# EAGLE design WiFi-Bee_v10 (EAGLE 7.7.0)
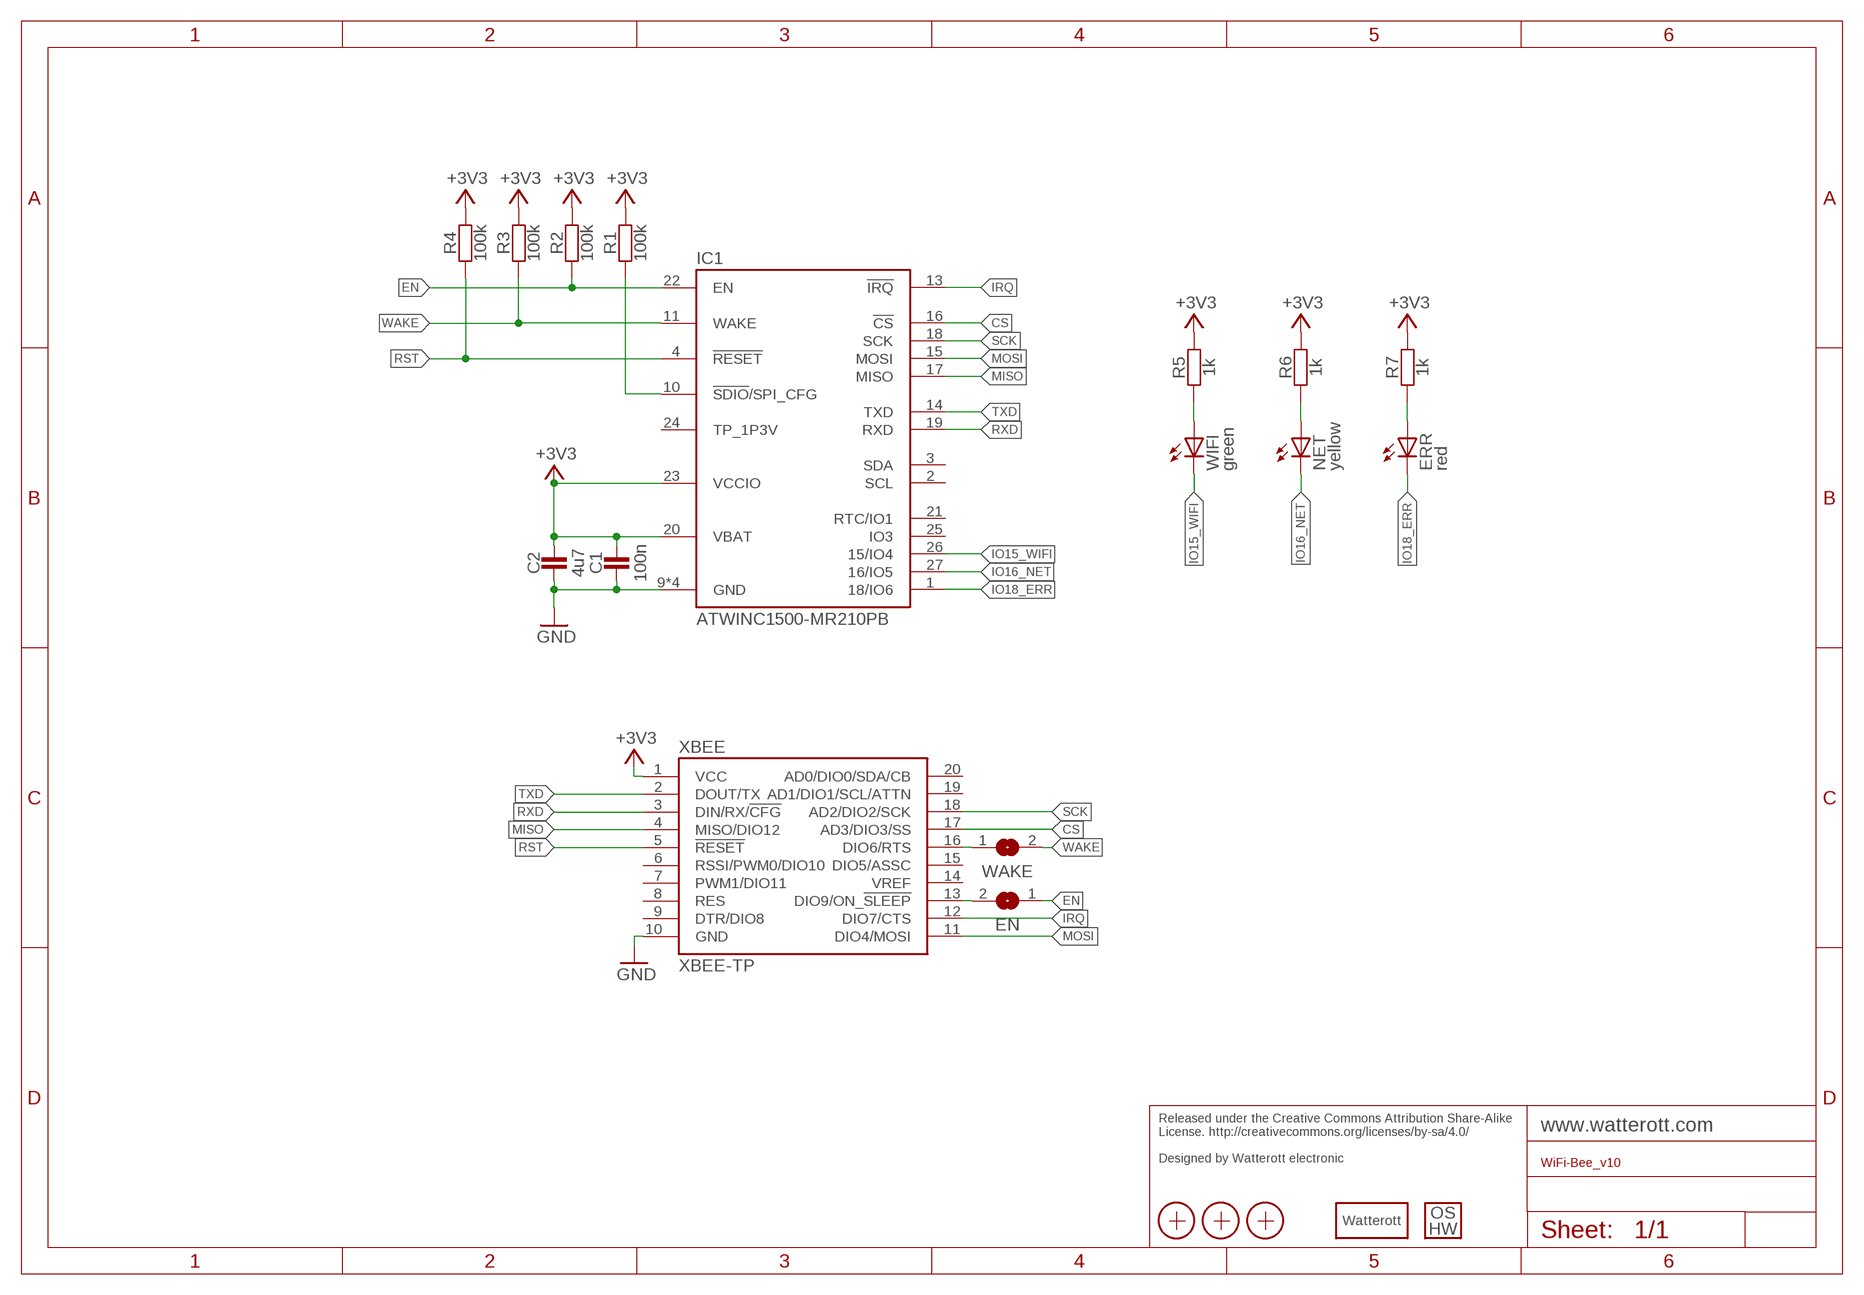
[diagram p0: schematic, sheet 1]

## Parts
C1  100n  CAPACITOR-0402  [C0402]
C2  4u7  CAPACITOR-0402  [C0402]
EN  JUMPER2-0402  [JUMPER2-0402]
ERR  red  LED-0603  [C0603]
IC1  ATWINC1500-MR210PB  [ATWINC1500-MX210]
LOGO3  LOGO_SPARK-2  [SPARK_2MM]
LOGO4  LOGO_OSHW-2  [OSHW_2MM]
NET  yellow  LED-0603  [C0603]
R1  100k  RESISTOR-0402  [C0402]
R2  100k  RESISTOR-0402  [C0402]
R3  100k  RESISTOR-0402  [C0402]
R4  100k  RESISTOR-0402  [C0402]
R5  1k  RESISTOR-0402  [C0402]
R6  1k  RESISTOR-0402  [C0402]
R7  1k  RESISTOR-0402  [C0402]
WAKE  JUMPER2-0402  [JUMPER2-0402]
WIFI  green  LED-0603  [C0603]
X1  PASSER-07  [PASSER_07MM]
X2  PASSER-07  [PASSER_07MM]
X3  PASSER-07  [PASSER_07MM]
XBEE  XBEE-TP  [XBEE_TP]

## Nets
+3V3: C1.2 C2.2 IC1.20(VBAT) IC1.23(VCCIO) R1.2 R2.2 R3.2 R4.2 R5.2 R6.2 R7.2 XBEE.1(VCC)
CFG: IC1.10(!SDIO!/SPI_CFG) R1.1
CS: IC1.16(!CS) XBEE.17(AD3/DIO3/SS)
EN: EN.1 IC1.22(EN) R2.1
EN2: EN.2 XBEE.13(DIO9/ON_!SLEEP!)
GND: C1.1 C2.1 IC1.9(GND) IC1.12(GND) IC1.28(GND) IC1.GND XBEE.10(GND)
IO15_WIFI: IC1.26(15/IO4) WIFI.C
IO16_NET: IC1.27(16/IO5) NET.C
IO18_ERR: ERR.C IC1.1(18/IO6)
IRQ: IC1.13(!IRQ) XBEE.12(DIO7/CTS)
LEDE: ERR.A R7.1
LEDN: NET.A R6.1
LEDW: R5.1 WIFI.A
MISO: IC1.17(MISO) XBEE.4(MISO/DIO12)
MOSI: IC1.15(MOSI) XBEE.11(DIO4/MOSI)
RST: IC1.4(!RESET) R4.1 XBEE.5(!RESET!)
RXD: IC1.19(RXD) XBEE.3(DIN/RX/!CFG!)
SCK: IC1.18(SCK) XBEE.18(AD2/DIO2/SCK)
TXD: IC1.14(TXD) XBEE.2(DOUT/TX)
WAKE: IC1.11(WAKE) R3.1 WAKE.2
WAKE1: WAKE.1 XBEE.16(DIO6/RTS)
Unconnected: IC1.2(SCL) IC1.3(SDA) IC1.21(RTC/IO1) IC1.24(TP_1P3V) IC1.25(IO3) XBEE.6(RSSI/PWM0/DIO10) XBEE.7(PWM1/DIO11) XBEE.8(RES) XBEE.9(DTR/DIO8) XBEE.14(VREF) XBEE.15(DIO5/ASSC) XBEE.19(AD1/DIO1/SCL/ATTN) XBEE.20(AD0/DIO0/SDA/CB)

## Notes on the sheet
- Released under the Creative Commons Attribution Share-Alike 
  License. http://creativecommons.org/licenses/by-sa/4.0/
  
  Designed by Watterott electronic

## Library data of the parts
C1 C2 = we-rcl:CAPACITOR: Capacitors ...2.2uF @ 6.3V -> 0402 ...4.7uF @ 6.3V -> 0603 ...10uF @ 16V -> 0805 ...22uF @ 25V -> 1206
EN WAKE = we-rcl:JUMPER2: 2 Pin Jumpers
ERR NET WIFI = we-opto:LED: LEDs red, green, blue -> 0603
IC1 = we-chip:ATWINC1500: Microchip ATWINC1500 WiFi/WLAN 802.11 b/g/n MR210PB - PCB antenna MR210UB - uFL connector WINC1500 - 4Mb Flash WINC1510 - 8Mb Flash
LOGO3 = we-symbol:LOGO_SPARK: Watterott electronic Logo
LOGO4 = we-symbol:LOGO_OSHW: Open-Source-Hardware Logo
R1-R7 = we-rcl:RESISTOR: Resistors all kinds in 0402 and 0603
X1-X3 = we-symbol:PASSER: Fiducial Markers
XBEE = we-board:XBEE: XBEE connector

## Board
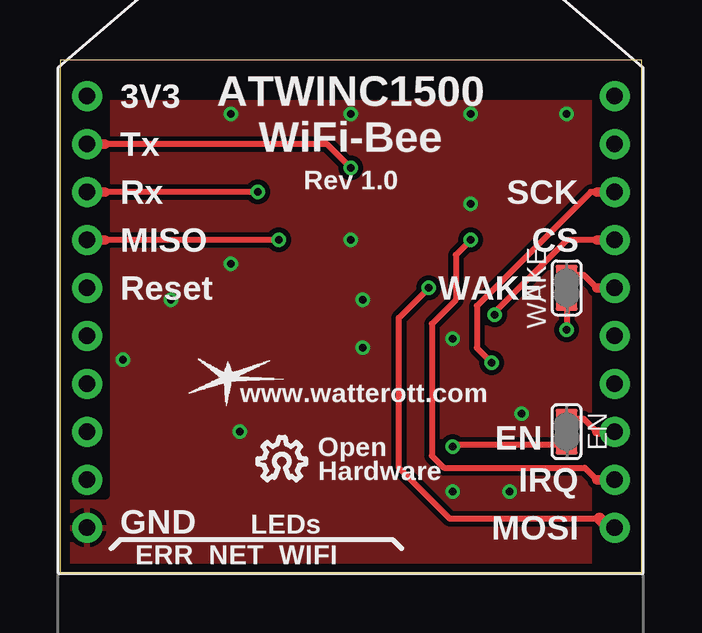
[diagram p1: board, top side]
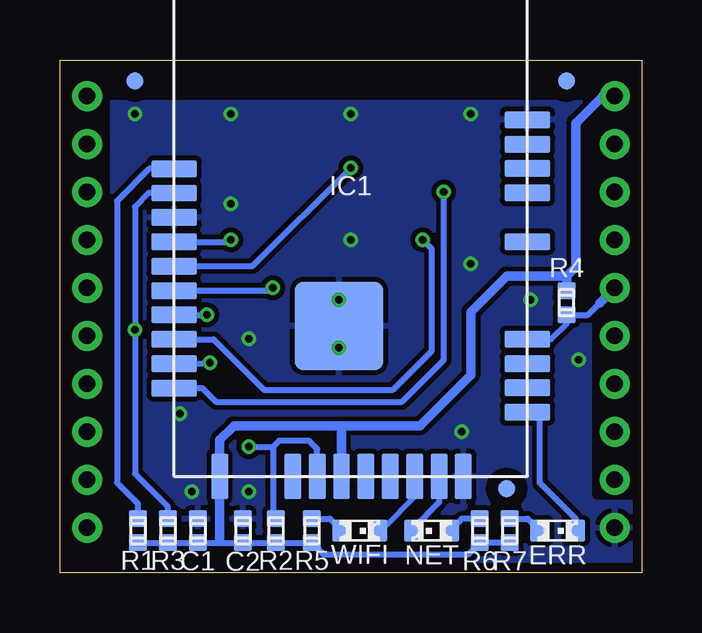
[diagram p2: board, bottom side, seen from below]

Size 24.25 x 21.38 mm. Coordinates in mm from the lower left corner, seen from the top.
Outline: 24.25,0 24.25,21.38 0,21.38 0,0 24.25,0
Copper layers (1*16): Top 0.035mm / dielectric 1.5mm / Bottom 0.035mm
Design rules "we-dru-2-layer *": minimum track width 0.15mm, minimum drill 0.3mm, track to track 0.15mm, track to pad 0.15mm, pad to pad 0.15mm, via to via 0.15mm, smd to smd 0.1mm, copper to edge 0.4mm, drill to drill 0.2mm, minimum pad ring 0.18mm, minimum via ring 0.16mm, stop-mask expansion 0.1mm, vias tented up to drill 0.5mm, thermal gap 0.2mm
tRestrict: area 0.4,3.2 to 1.9,20.8; area 22.4,0.4 to 23.9,20.8
bRestrict: area 0.4,3.2 to 1.9,20.8; area 22.4,0.4 to 23.9,20.8

### Footprints (pad centres in the part's own frame; a part is rotated, then mirrored left to right if it is on the bottom)
C0402 = smd 0.75 x 0.7: 1 0,0.5; 2 0,-0.5
JUMPER2-0402 = smd 0.9 x 0.8: 1 0,0.55; 2 0,-0.55
C0603 = smd 0.9 x 0.8: A 0,-0.75; C 0,0.75
ATWINC1500-MX210 = smd 1.9 x 0.7: 1 7.365,-8.19; 2 7.365,-7.174; 3 7.365,-6.158; 4 7.365,-5.142; 5 7.365,-1.078; 6 7.365,0.954; 7 7.365,1.97; 8 7.365,2.986; 9 7.365,4.002; 10 -7.365,1.964; 11 -7.365,0.948; 12 -7.365,-0.068; 13 -7.365,-1.084; 14 -7.365,-2.1; 15 -7.365,-3.116; 16 -7.365,-4.132; 17 -7.365,-5.148; 18 -7.365,-6.164; 19 -7.365,-7.18 | smd 0.7 x 1.9: 20 -5.465,-10.86; 21 -2.417,-10.86; 22 -1.401,-10.86; 23 -0.385,-10.86; 24 0.631,-10.86; 25 1.647,-10.86; 26 2.663,-10.86; 27 3.679,-10.86; 28 4.695,-10.86 | smd 3.7 x 3.7: GND -0.485,-4.59
PASSER_07MM = smd 0.7 x 0.7: X 0,0
XBEE_TP = drill 0.7 pad 1.25: 1 -11,9; 2 -11,7; 3 -11,5; 4 -11,3; 5 -11,1; 6 -11,-1; 7 -11,-3; 8 -11,-5; 9 -11,-7; 10 -11,-9; 11 11,-9; 12 11,-7; 13 11,-5; 14 11,-3; 15 11,-1; 16 11,1; 17 11,3; 18 11,5; 19 11,7; 20 11,9

### Placement (x,y rotation side)
C1  18.5,1.75 0 bottom
C2  16.62,1.75 0 bottom
EN  21.12,5.88 180 top
ERR  3.5,1.75 270 bottom
IC1  12.12,14.88 0 bottom
LOGO3  7,8.12 0 top
LOGO4  9.25,4.75 0 top
NET  8.75,1.75 90 bottom
R1  21,1.75 0 bottom
R2  15.25,1.75 0 bottom
R3  19.75,1.75 0 bottom
R4  3.12,11.25 180 bottom
R5  13.75,1.75 0 bottom
R6  6.75,1.75 0 bottom
R7  5.5,1.75 0 bottom
WAKE  21.12,11.88 0 top
WIFI  11.75,1.75 270 bottom
X1  5.62,3.5 0 bottom
X2  3.12,20.5 0 bottom
X3  21.12,20.5 0 bottom
XBEE  12.12,10.88 0 top

### Tracks (layer width: path | path; a pad name or v marks a point on that pad's centre or on a via)
+3V3
  Bottom 0.25: R1.2 R3.2 C1.2 17.5,1.25 | 17.5,1.25 C2.2 R2.2 R5.2 13.25,0.75 7.25,0.75 R6.2 R7.2 | 17.59,1.34 17.5,1.25
  Bottom 0.4: 12.5,6.12 17,6.12 17.59,5.54 IC1.20 17.59,1.34 | XBEE.1 1.62,19.88 2.75,18.75 2.75,12.75 3.12,12.38 | 12.5,6.12 9.25,6.12 7.12,8.25 7.12,10.88 5.62,12.38 3.12,12.38 | R4.2 3.12,12.38 | IC1.23 12.51,6.12 12.5,6.12
CFG
  Bottom 0.25: IC1.10 20.54,16.84 21.88,15.5 21.88,3.75 21,2.88 R1.1
CS  (via drill 0.3)
  Top 0.25: 22.38,13.88 21.12,13.88 18.12,10.88 v18.12,10.75
  Top 0.4: XBEE.17 22.38,13.88
  Bottom 0.25: IC1.16 18.13,10.74 v18.12,10.75
EN  (via drill 0.3)
  Top 0.25: EN.1 16.45,5.33 v16.38,5.25
  Bottom 0.25: IC1.22 13.53,5.15 13.88,5.5 15.12,5.5 15.38,5.25 | 15.38,5.25 15.38,2.38 R2.1 | v16.38,5.25 15.38,5.25
EN2
  Top 0.25: 22.38,5.88 21.82,6.42 EN.2
  Top 0.4: XBEE.13 22.38,5.88
GND  (via drill 0.3)
  other vias: 7.12,19.12 12.12,19.12 16.38,3.38 17.12,15.38 12.62,11.38 17.12,19.12 7.5,5.88 21.12,19.12 18.75,3.38 2.62,8.88 19.25,6.62 16.38,9.75 12.12,13.88 7.12,12.88 4.62,11.38 12.62,9.38
  pour Top (isolate 0.2, rank 2): 24.25,0 0,0 0,19.62 24.25,19.62
  pour Bottom (isolate 0.2, rank 2): 0,0 24.25,0 24.25,19.62 0,19.62
IO15_WIFI
  Bottom 0.2: IC1.26 9.46,3.16 10.75,1.88 10.88,1.88 WIFI.C
IO16_NET
  Bottom 0.25: IC1.27 8.45,2.93 9.5,1.88 NET.C
IO18_ERR
  Bottom 0.25: ERR.C 2.75,2.25 4.25,3.75 4.25,6.62 4.7,6.62 IC1.1
IRQ  (via drill 0.3)
  Top 0.25: v17.12,13.88 16.5,13.25 16.5,11.38 15.5,10.38 15.5,4.88 16,4.38 21.88,4.38 22.38,3.88
  Top 0.4: 22.38,3.88 XBEE.12
  Bottom 0.25: IC1.13 17.21,13.79 v17.12,13.88
LEDE
  Bottom 0.25: R7.1 4.75,2.25 ERR.A
LEDN
  Bottom 0.25: R6.1 7.5,2.25 NET.A
LEDW
  Bottom 0.25: R5.1 13,2.25 WIFI.A
MISO  (via drill 0.3)
  Top 0.25: v9.12,13.88 1.88,13.88
  Top 0.4: 1.88,13.88 XBEE.4
  Bottom 0.25: v9.12,13.88 8.75,13.5 8.75,9.25 10.38,7.62 15.75,7.62 17.85,9.73 IC1.17
MOSI  (via drill 0.3)
  Top 0.25: v15.38,11.88 14.12,10.62 14.12,4.38 16.25,2.25 22.5,2.25
  Top 0.5: XBEE.11 22.88,1.88 22.5,2.25
  Bottom 0.25: IC1.15 15.49,11.76 v15.38,11.88
RST
  Bottom 0.25: IC1.4 3.77,9.73 3.12,10.38 R4.1 2.25,10.75 1.75,11.25
  Bottom 0.4: XBEE.5 1.75,11.25
RXD  (via drill 0.3)
  Top 0.25: v8.25,15.88 1.88,15.88
  Top 0.4: 1.88,15.88 XBEE.3
  Bottom 0.25: v8.25,15.88 8.25,8.88 10,7.12 17.75,7.12 18.32,7.7 IC1.19
SCK  (via drill 0.3)
  Top 0.25: 22.38,15.88 22.12,15.88 17.38,11.12 17.38,9.38 v18,8.75
  Top 0.4: XBEE.18 22.38,15.88
  Bottom 0.25: IC1.18 18.04,8.71 v18,8.75
TXD  (via drill 0.3)
  Top 0.25: v12.12,16.88 11.12,17.88 1.88,17.88
  Top 0.4: 1.88,17.88 XBEE.2
  Bottom 0.25: v12.12,16.88 16.23,12.78 IC1.14
WAKE  (via drill 0.3)
  Top 0.25: WAKE.2 v21.12,10.12
  Bottom 0.25: IC1.11 20.55,15.82 21.12,15.25 v21.12,10.12 21.12,4.12 19.75,2.75 R3.1
WAKE1
  Top 0.25: 22.38,11.88 21.82,12.43 WAKE.1
  Top 0.4: XBEE.16 22.38,11.88

### Text on the board
tPlace: 3V3 | ATWINC1500 / WiFi-Bee | Tx | Rev 1.0 | Rx | SCK | MISO | CS | Reset | WAKE | www.watterott.com | EN | Open | Hardware | IRQ | GND | LEDs | MOSI | ERR NET WIFI
Reference: Silkscreen: 21 tPlace